# EasyEDA schematic SCH_SIT210_PCB_Files_2022-05-17.json
TITLE: Sheet_1; REV: 1.0; Date: 2022-05-17; Sheet: 1/1; Drawn By: foxymum; Company: Your Company
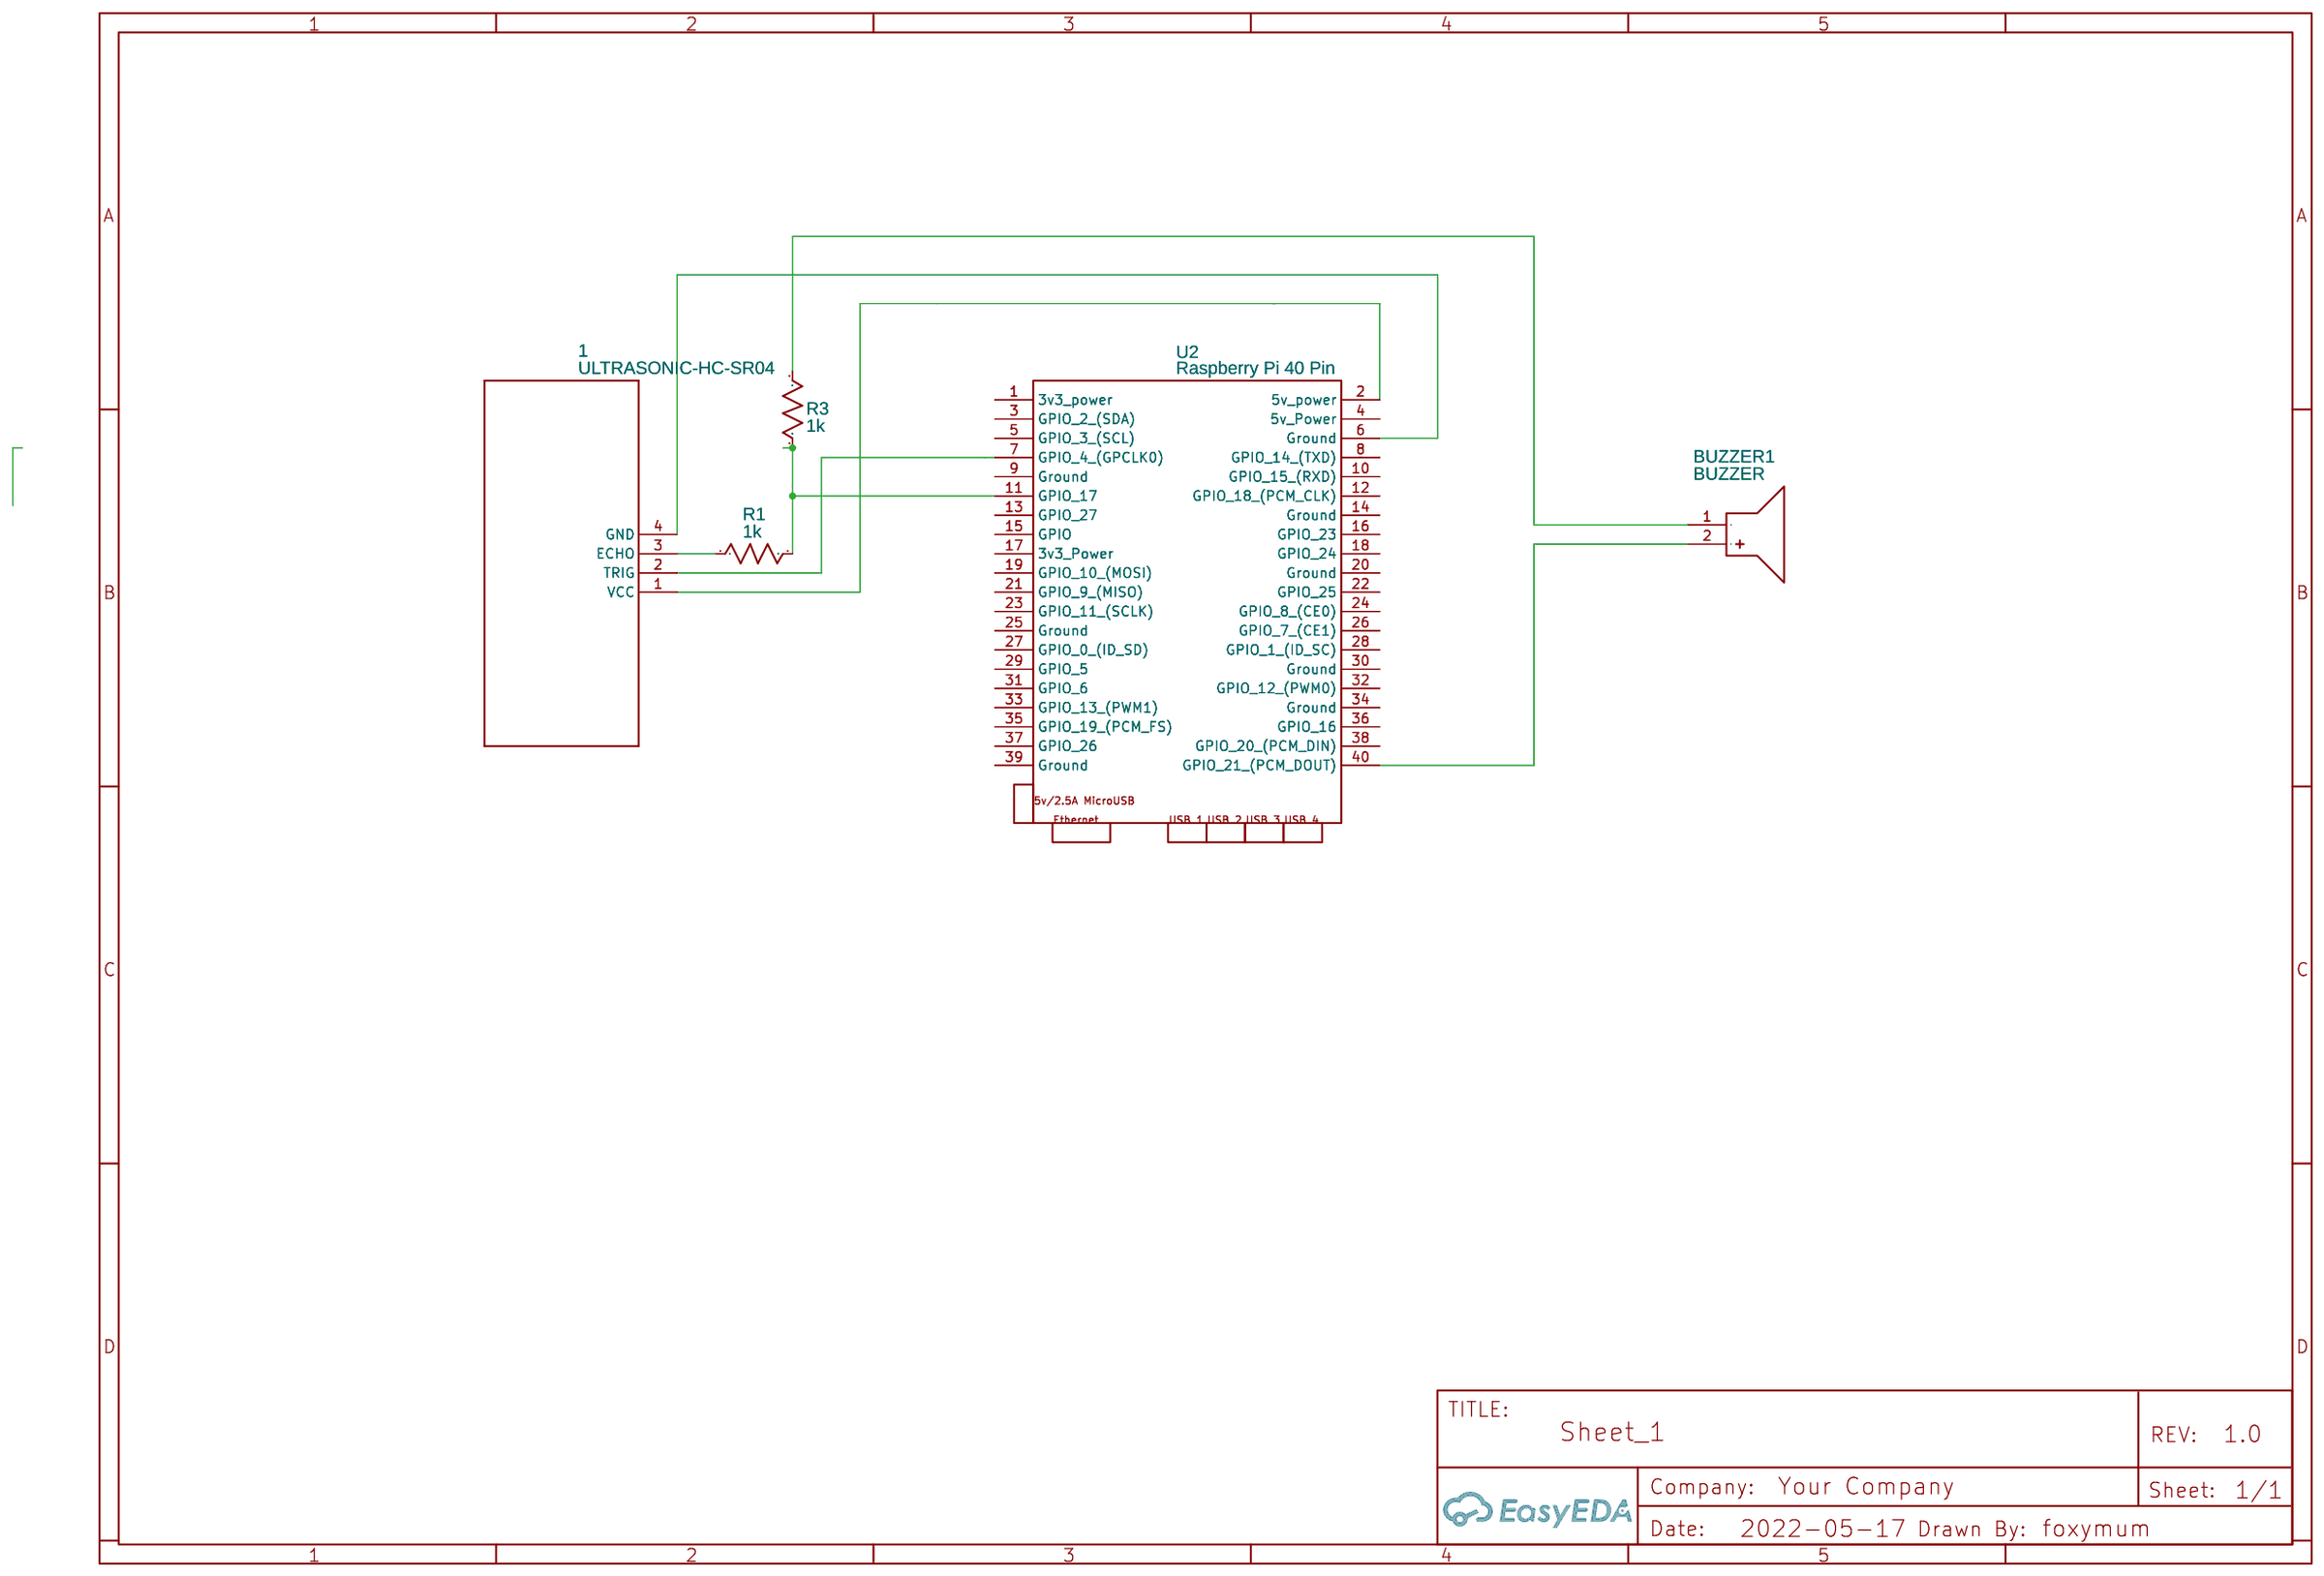
[diagram p0: schematic sheet]

## Parts
1  ULTRASONIC-HC-SR04  [ULTRASONIC-HC-SR04]
BUZZER1  BUZZER  [BUZ-TH_BD12.0-P6.00-D0.9-RD]
R1  1k  [R0603]
R3  1k  [R0603]
U2  Raspberry Pi 40 Pin

## Library data of the parts
1 = ULTRASONIC-HC-SR04: Contributor: Otto Sonneveld
BUZZER1 = BUZZER: Supplier: LCSC; Supplier Part: C9900014030; Manufacturer: null; Manufacturer Part: buzzer; JLCPCB Part Class: Extended Part; Contributor: lcsc
R1 R3 = R_0603_US: Contributor: LCEDA_Lib
U2 = Raspberry Pi 40 Pin: Contributor: lostkangaroo

## Nets
Net-(1-1): 1.1(VCC) U2.2(5v power)
Net-(1-2): 1.2(TRIG) U2.7(GPIO 4 (GPCLK0))
Net-(1-3): 1.3(ECHO) R1.1
Net-(1-4): 1.4(GND) U2.6(Ground)
Net-(BUZZER1-1): BUZZER1.1(-) R3.2
Net-(BUZZER1-2): BUZZER1.2(+) U2.40(GPIO 21 (PCM_DOUT))
Net-(R1-2): R1.2 R3.1 U2.11(GPIO 17)

Not connected (* = marked no-connect by the designer): U2 1(3v3 power) 3(GPIO 2 (SDA)) 4(5v Power) 5(GPIO 3 (SCL)) 8(GPIO 14 (TXD)) 9(Ground) 10(GPIO 15 (RXD)) 12(GPIO 18 (PCM_CLK)) 13(GPIO 27) 14(Ground) 15(GPIO) 16(GPIO 23) 17(3v3 Power) 18(GPIO 24) 19(GPIO 10 (MOSI)) 20(Ground) 21(GPIO 9 (MISO)) 22(GPIO 25) 23(GPIO 11 (SCLK)) 24(GPIO 8 (CE0)) 25(Ground) 26(GPIO 7 (CE1)) 27(GPIO 0 (ID_SD)) 28(GPIO 1 (ID_SC)) 29(GPIO 5) 30(Ground) 31(GPIO 6) 32(GPIO 12 (PWM0)) 33(GPIO 13 (PWM1)) 34(Ground) 35(GPIO 19 (PCM_FS)) 36(GPIO 16) 37(GPIO 26) 38(GPIO 20 (PCM_DIN)) 39(Ground)
